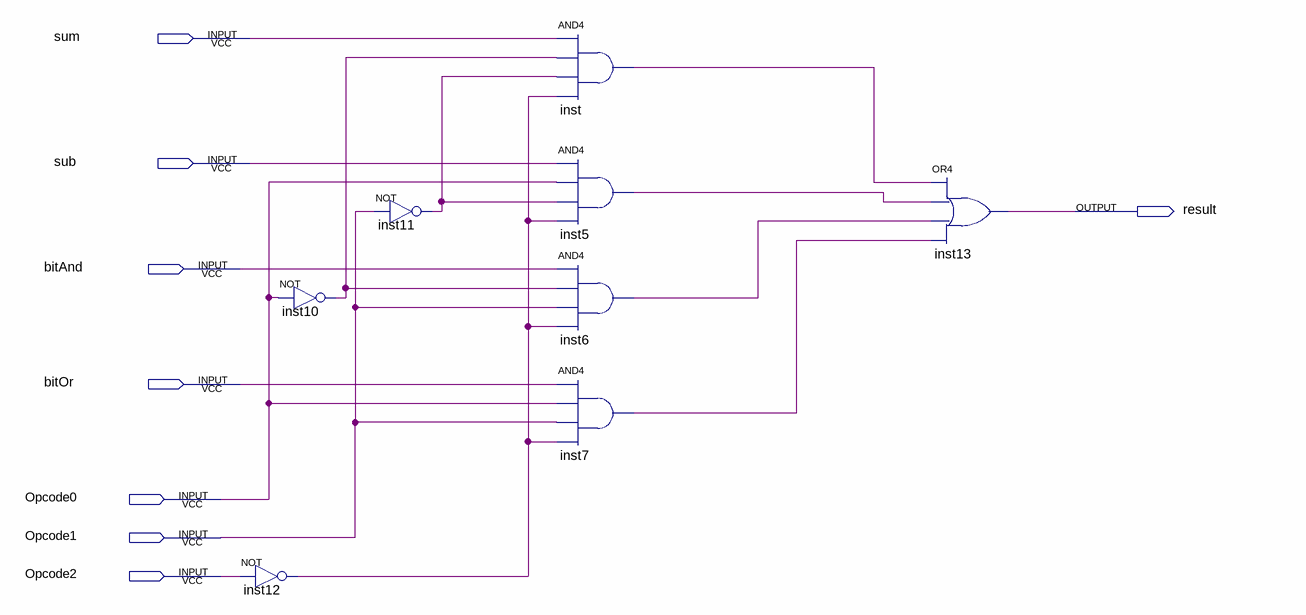
[diagram p0: schematic sheet]
// Quartus schematic 41Mux.bdf as structural Verilog: 8 symbols, 8 pins
module \41Mux  (
  input  sum,
  input  sub,
  input  bitAnd,
  input  bitOr,
  input  Opcode0,
  input  Opcode1,
  input  Opcode2,
  output result
);

  wire inst5_out, inst6_out, inst7_out, inst10_out, inst11_out, inst12_out, inst_out;

  not inst12 (inst12_out, Opcode2);
  not inst10 (inst10_out, Opcode0);
  not inst11 (inst11_out, Opcode1);
  and inst (inst_out, sum, inst10_out, inst11_out, inst12_out);
  and inst5 (inst5_out, sub, Opcode0, inst11_out, inst12_out);
  and inst6 (inst6_out, bitAnd, inst10_out, Opcode1, inst12_out);
  and inst7 (inst7_out, bitOr, Opcode0, Opcode1, inst12_out);
  or inst13 (result, inst_out, inst5_out, inst6_out, inst7_out);
endmodule
